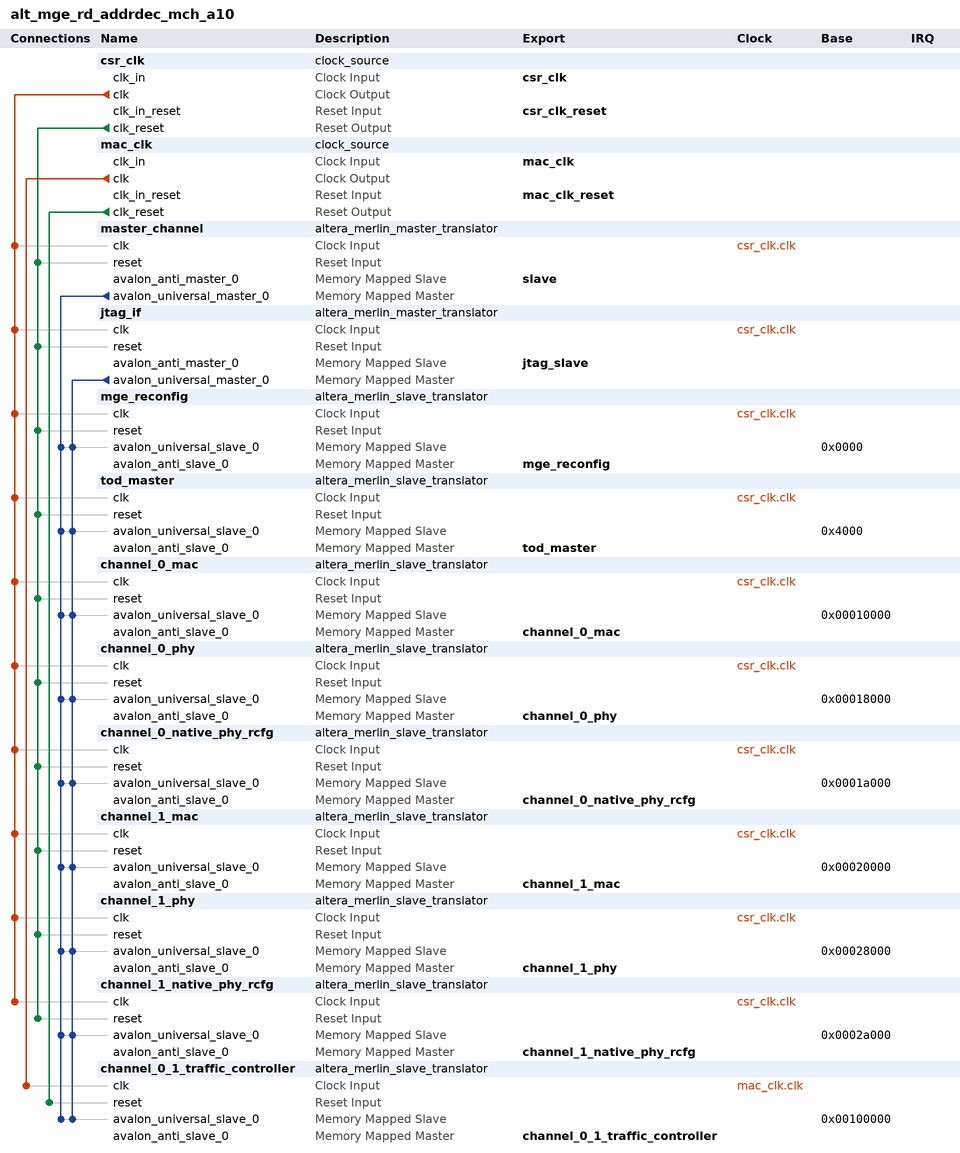
[diagram p0: system contents]
# Platform Designer (Qsys) system alt_mge_rd_addrdec_mch_a10, Arria 10 10AX115S4F45I3SG
# Parameters at their usual value, and those the tool derives, are not listed.
package require -exact qsys 15.1
create_system alt_mge_rd_addrdec_mch_a10
set_project_property DEVICE_FAMILY {Arria 10}
set_project_property DEVICE 10AX115S4F45I3SG

add_instance csr_clk clock_source 15.1
set_instance_parameter_value csr_clk clockFrequency 125000000

add_instance mac_clk clock_source 15.1
set_instance_parameter_value mac_clk clockFrequency 156250000

add_instance master_channel altera_merlin_master_translator 15.1
set_instance_parameter_value master_channel AV_ADDRESSGROUP 0
set_instance_parameter_value master_channel AV_ADDRESS_SYMBOLS 1
set_instance_parameter_value master_channel AV_ADDRESS_W 24
set_instance_parameter_value master_channel AV_ALWAYSBURSTMAXBURST 0
set_instance_parameter_value master_channel AV_BITS_PER_SYMBOL 8
set_instance_parameter_value master_channel AV_BURSTBOUNDARIES 0
set_instance_parameter_value master_channel AV_BURSTCOUNT_SYMBOLS 1
set_instance_parameter_value master_channel AV_BURSTCOUNT_W 3
set_instance_parameter_value master_channel AV_BYTEENABLE_W 4
set_instance_parameter_value master_channel AV_CONSTANT_BURST_BEHAVIOR 0
set_instance_parameter_value master_channel AV_DATA_HOLD 0
set_instance_parameter_value master_channel AV_DATA_W 32
set_instance_parameter_value master_channel AV_INTERLEAVEBURSTS 0
set_instance_parameter_value master_channel AV_ISBIGENDIAN 0
set_instance_parameter_value master_channel AV_LINEWRAPBURSTS 0
set_instance_parameter_value master_channel AV_MAX_PENDING_READ_TRANSACTIONS 0
set_instance_parameter_value master_channel AV_READLATENCY 0
set_instance_parameter_value master_channel AV_READ_WAIT 0
set_instance_parameter_value master_channel AV_REGISTERINCOMINGSIGNALS 0
set_instance_parameter_value master_channel AV_REGISTEROUTGOINGSIGNALS 0
set_instance_parameter_value master_channel AV_SETUP_WAIT 0
set_instance_parameter_value master_channel AV_SYMBOLS_PER_WORD 4
set_instance_parameter_value master_channel AV_WRITE_WAIT 0
set_instance_parameter_value master_channel SYNC_RESET 0
set_instance_parameter_value master_channel UAV_ADDRESSGROUP 0
set_instance_parameter_value master_channel UAV_ADDRESS_W 32
set_instance_parameter_value master_channel UAV_BURSTCOUNT_W 3
set_instance_parameter_value master_channel UAV_CONSTANT_BURST_BEHAVIOR 0
set_instance_parameter_value master_channel USE_ADDRESS 1
set_instance_parameter_value master_channel USE_BEGINBURSTTRANSFER 0
set_instance_parameter_value master_channel USE_BEGINTRANSFER 0
set_instance_parameter_value master_channel USE_BURSTCOUNT 0
set_instance_parameter_value master_channel USE_BYTEENABLE 0
set_instance_parameter_value master_channel USE_CHIPSELECT 0
set_instance_parameter_value master_channel USE_CLKEN 0
set_instance_parameter_value master_channel USE_DEBUGACCESS 0
set_instance_parameter_value master_channel USE_LOCK 0
set_instance_parameter_value master_channel USE_READ 1
set_instance_parameter_value master_channel USE_READDATA 1
set_instance_parameter_value master_channel USE_READDATAVALID 0
set_instance_parameter_value master_channel USE_READRESPONSE 0
set_instance_parameter_value master_channel USE_WAITREQUEST 1
set_instance_parameter_value master_channel USE_WRITE 1
set_instance_parameter_value master_channel USE_WRITEDATA 1
set_instance_parameter_value master_channel USE_WRITERESPONSE 0

add_instance jtag_if altera_merlin_master_translator 15.1
set_instance_parameter_value jtag_if AV_ADDRESSGROUP 0
set_instance_parameter_value jtag_if AV_ADDRESS_SYMBOLS 1
set_instance_parameter_value jtag_if AV_ADDRESS_W 32
set_instance_parameter_value jtag_if AV_ALWAYSBURSTMAXBURST 0
set_instance_parameter_value jtag_if AV_BITS_PER_SYMBOL 8
set_instance_parameter_value jtag_if AV_BURSTBOUNDARIES 0
set_instance_parameter_value jtag_if AV_BURSTCOUNT_SYMBOLS 1
set_instance_parameter_value jtag_if AV_BURSTCOUNT_W 3
set_instance_parameter_value jtag_if AV_BYTEENABLE_W 4
set_instance_parameter_value jtag_if AV_CONSTANT_BURST_BEHAVIOR 0
set_instance_parameter_value jtag_if AV_DATA_HOLD 0
set_instance_parameter_value jtag_if AV_DATA_W 32
set_instance_parameter_value jtag_if AV_INTERLEAVEBURSTS 0
set_instance_parameter_value jtag_if AV_ISBIGENDIAN 0
set_instance_parameter_value jtag_if AV_LINEWRAPBURSTS 0
set_instance_parameter_value jtag_if AV_MAX_PENDING_READ_TRANSACTIONS 1
set_instance_parameter_value jtag_if AV_READLATENCY 0
set_instance_parameter_value jtag_if AV_READ_WAIT 0
set_instance_parameter_value jtag_if AV_REGISTERINCOMINGSIGNALS 0
set_instance_parameter_value jtag_if AV_REGISTEROUTGOINGSIGNALS 0
set_instance_parameter_value jtag_if AV_SETUP_WAIT 0
set_instance_parameter_value jtag_if AV_SYMBOLS_PER_WORD 4
set_instance_parameter_value jtag_if AV_WRITE_WAIT 0
set_instance_parameter_value jtag_if SYNC_RESET 0
set_instance_parameter_value jtag_if UAV_ADDRESSGROUP 0
set_instance_parameter_value jtag_if UAV_ADDRESS_W 32
set_instance_parameter_value jtag_if UAV_BURSTCOUNT_W 3
set_instance_parameter_value jtag_if UAV_CONSTANT_BURST_BEHAVIOR 0
set_instance_parameter_value jtag_if USE_ADDRESS 1
set_instance_parameter_value jtag_if USE_BEGINBURSTTRANSFER 0
set_instance_parameter_value jtag_if USE_BEGINTRANSFER 0
set_instance_parameter_value jtag_if USE_BURSTCOUNT 0
set_instance_parameter_value jtag_if USE_BYTEENABLE 0
set_instance_parameter_value jtag_if USE_CHIPSELECT 0
set_instance_parameter_value jtag_if USE_CLKEN 0
set_instance_parameter_value jtag_if USE_DEBUGACCESS 0
set_instance_parameter_value jtag_if USE_LOCK 0
set_instance_parameter_value jtag_if USE_READ 1
set_instance_parameter_value jtag_if USE_READDATA 1
set_instance_parameter_value jtag_if USE_READDATAVALID 1
set_instance_parameter_value jtag_if USE_READRESPONSE 0
set_instance_parameter_value jtag_if USE_WAITREQUEST 1
set_instance_parameter_value jtag_if USE_WRITE 1
set_instance_parameter_value jtag_if USE_WRITEDATA 1
set_instance_parameter_value jtag_if USE_WRITERESPONSE 0

add_instance mge_reconfig altera_merlin_slave_translator 15.1
set_instance_parameter_value mge_reconfig AV_ADDRESSGROUP 0
set_instance_parameter_value mge_reconfig AV_ADDRESS_SYMBOLS 0
set_instance_parameter_value mge_reconfig AV_ADDRESS_W 2
set_instance_parameter_value mge_reconfig AV_ALWAYSBURSTMAXBURST 0
set_instance_parameter_value mge_reconfig AV_BITS_PER_SYMBOL 8
set_instance_parameter_value mge_reconfig AV_BURSTBOUNDARIES 0
set_instance_parameter_value mge_reconfig AV_BURSTCOUNT_SYMBOLS 1
set_instance_parameter_value mge_reconfig AV_BURSTCOUNT_W 1
set_instance_parameter_value mge_reconfig AV_BYTEENABLE_W 4
set_instance_parameter_value mge_reconfig AV_CONSTANT_BURST_BEHAVIOR 0
set_instance_parameter_value mge_reconfig AV_DATA_HOLD 0
set_instance_parameter_value mge_reconfig AV_DATA_W 32
set_instance_parameter_value mge_reconfig AV_INTERLEAVEBURSTS 0
set_instance_parameter_value mge_reconfig AV_ISBIGENDIAN 0
set_instance_parameter_value mge_reconfig AV_LINEWRAPBURSTS 0
set_instance_parameter_value mge_reconfig AV_MAX_PENDING_READ_TRANSACTIONS 1
set_instance_parameter_value mge_reconfig AV_MAX_PENDING_WRITE_TRANSACTIONS 0
set_instance_parameter_value mge_reconfig AV_READLATENCY 1
set_instance_parameter_value mge_reconfig AV_READ_WAIT 0
set_instance_parameter_value mge_reconfig AV_REGISTERINCOMINGSIGNALS 0
set_instance_parameter_value mge_reconfig AV_REGISTEROUTGOINGSIGNALS 0
set_instance_parameter_value mge_reconfig AV_REQUIRE_UNALIGNED_ADDRESSES 0
set_instance_parameter_value mge_reconfig AV_SETUP_WAIT 0
set_instance_parameter_value mge_reconfig AV_SYMBOLS_PER_WORD 4
set_instance_parameter_value mge_reconfig AV_TIMING_UNITS 1
set_instance_parameter_value mge_reconfig AV_WRITE_WAIT 0
set_instance_parameter_value mge_reconfig CHIPSELECT_THROUGH_READLATENCY 0
set_instance_parameter_value mge_reconfig CLOCK_RATE 125000000
set_instance_parameter_value mge_reconfig UAV_ADDRESSGROUP 0
set_instance_parameter_value mge_reconfig UAV_ADDRESS_W 4
set_instance_parameter_value mge_reconfig UAV_BURSTCOUNT_W 3
set_instance_parameter_value mge_reconfig UAV_BYTEENABLE_W 4
set_instance_parameter_value mge_reconfig UAV_CONSTANT_BURST_BEHAVIOR 0
set_instance_parameter_value mge_reconfig UAV_DATA_W 32
set_instance_parameter_value mge_reconfig USE_ADDRESS 1
set_instance_parameter_value mge_reconfig USE_AV_CLKEN 0
set_instance_parameter_value mge_reconfig USE_BEGINBURSTTRANSFER 0
set_instance_parameter_value mge_reconfig USE_BEGINTRANSFER 0
set_instance_parameter_value mge_reconfig USE_BURSTCOUNT 0
set_instance_parameter_value mge_reconfig USE_BYTEENABLE 0
set_instance_parameter_value mge_reconfig USE_CHIPSELECT 0
set_instance_parameter_value mge_reconfig USE_DEBUGACCESS 0
set_instance_parameter_value mge_reconfig USE_LOCK 0
set_instance_parameter_value mge_reconfig USE_OUTPUTENABLE 0
set_instance_parameter_value mge_reconfig USE_READ 1
set_instance_parameter_value mge_reconfig USE_READDATA 1
set_instance_parameter_value mge_reconfig USE_READDATAVALID 0
set_instance_parameter_value mge_reconfig USE_READRESPONSE 0
set_instance_parameter_value mge_reconfig USE_UAV_CLKEN 0
set_instance_parameter_value mge_reconfig USE_WAITREQUEST 0
set_instance_parameter_value mge_reconfig USE_WRITE 1
set_instance_parameter_value mge_reconfig USE_WRITEBYTEENABLE 0
set_instance_parameter_value mge_reconfig USE_WRITEDATA 1
set_instance_parameter_value mge_reconfig USE_WRITERESPONSE 0

add_instance tod_master altera_merlin_slave_translator 15.1
set_instance_parameter_value tod_master AV_ADDRESSGROUP 0
set_instance_parameter_value tod_master AV_ADDRESS_SYMBOLS 0
set_instance_parameter_value tod_master AV_ADDRESS_W 4
set_instance_parameter_value tod_master AV_ALWAYSBURSTMAXBURST 0
set_instance_parameter_value tod_master AV_BITS_PER_SYMBOL 8
set_instance_parameter_value tod_master AV_BURSTBOUNDARIES 0
set_instance_parameter_value tod_master AV_BURSTCOUNT_SYMBOLS 1
set_instance_parameter_value tod_master AV_BURSTCOUNT_W 1
set_instance_parameter_value tod_master AV_BYTEENABLE_W 4
set_instance_parameter_value tod_master AV_CONSTANT_BURST_BEHAVIOR 0
set_instance_parameter_value tod_master AV_DATA_HOLD 0
set_instance_parameter_value tod_master AV_DATA_W 32
set_instance_parameter_value tod_master AV_INTERLEAVEBURSTS 0
set_instance_parameter_value tod_master AV_ISBIGENDIAN 0
set_instance_parameter_value tod_master AV_LINEWRAPBURSTS 0
set_instance_parameter_value tod_master AV_MAX_PENDING_READ_TRANSACTIONS 1
set_instance_parameter_value tod_master AV_MAX_PENDING_WRITE_TRANSACTIONS 0
set_instance_parameter_value tod_master AV_READLATENCY 0
set_instance_parameter_value tod_master AV_READ_WAIT 0
set_instance_parameter_value tod_master AV_REGISTERINCOMINGSIGNALS 0
set_instance_parameter_value tod_master AV_REGISTEROUTGOINGSIGNALS 0
set_instance_parameter_value tod_master AV_REQUIRE_UNALIGNED_ADDRESSES 0
set_instance_parameter_value tod_master AV_SETUP_WAIT 0
set_instance_parameter_value tod_master AV_SYMBOLS_PER_WORD 4
set_instance_parameter_value tod_master AV_TIMING_UNITS 1
set_instance_parameter_value tod_master AV_WRITE_WAIT 0
set_instance_parameter_value tod_master CHIPSELECT_THROUGH_READLATENCY 0
set_instance_parameter_value tod_master CLOCK_RATE 125000000
set_instance_parameter_value tod_master UAV_ADDRESSGROUP 0
set_instance_parameter_value tod_master UAV_ADDRESS_W 6
set_instance_parameter_value tod_master UAV_BURSTCOUNT_W 3
set_instance_parameter_value tod_master UAV_BYTEENABLE_W 4
set_instance_parameter_value tod_master UAV_CONSTANT_BURST_BEHAVIOR 0
set_instance_parameter_value tod_master UAV_DATA_W 32
set_instance_parameter_value tod_master USE_ADDRESS 1
set_instance_parameter_value tod_master USE_AV_CLKEN 0
set_instance_parameter_value tod_master USE_BEGINBURSTTRANSFER 0
set_instance_parameter_value tod_master USE_BEGINTRANSFER 0
set_instance_parameter_value tod_master USE_BURSTCOUNT 0
set_instance_parameter_value tod_master USE_BYTEENABLE 0
set_instance_parameter_value tod_master USE_CHIPSELECT 0
set_instance_parameter_value tod_master USE_DEBUGACCESS 0
set_instance_parameter_value tod_master USE_LOCK 0
set_instance_parameter_value tod_master USE_OUTPUTENABLE 0
set_instance_parameter_value tod_master USE_READ 1
set_instance_parameter_value tod_master USE_READDATA 1
set_instance_parameter_value tod_master USE_READDATAVALID 0
set_instance_parameter_value tod_master USE_READRESPONSE 0
set_instance_parameter_value tod_master USE_UAV_CLKEN 0
set_instance_parameter_value tod_master USE_WAITREQUEST 1
set_instance_parameter_value tod_master USE_WRITE 1
set_instance_parameter_value tod_master USE_WRITEBYTEENABLE 0
set_instance_parameter_value tod_master USE_WRITEDATA 1
set_instance_parameter_value tod_master USE_WRITERESPONSE 0

add_instance channel_0_mac altera_merlin_slave_translator 15.1
set_instance_parameter_value channel_0_mac AV_ADDRESSGROUP 0
set_instance_parameter_value channel_0_mac AV_ADDRESS_SYMBOLS 0
set_instance_parameter_value channel_0_mac AV_ADDRESS_W 10
set_instance_parameter_value channel_0_mac AV_ALWAYSBURSTMAXBURST 0
set_instance_parameter_value channel_0_mac AV_BITS_PER_SYMBOL 8
set_instance_parameter_value channel_0_mac AV_BURSTBOUNDARIES 0
set_instance_parameter_value channel_0_mac AV_BURSTCOUNT_SYMBOLS 1
set_instance_parameter_value channel_0_mac AV_BURSTCOUNT_W 1
set_instance_parameter_value channel_0_mac AV_BYTEENABLE_W 4
set_instance_parameter_value channel_0_mac AV_CONSTANT_BURST_BEHAVIOR 0
set_instance_parameter_value channel_0_mac AV_DATA_HOLD 0
set_instance_parameter_value channel_0_mac AV_DATA_W 32
set_instance_parameter_value channel_0_mac AV_INTERLEAVEBURSTS 0
set_instance_parameter_value channel_0_mac AV_ISBIGENDIAN 0
set_instance_parameter_value channel_0_mac AV_LINEWRAPBURSTS 0
set_instance_parameter_value channel_0_mac AV_MAX_PENDING_READ_TRANSACTIONS 1
set_instance_parameter_value channel_0_mac AV_MAX_PENDING_WRITE_TRANSACTIONS 0
set_instance_parameter_value channel_0_mac AV_READLATENCY 0
set_instance_parameter_value channel_0_mac AV_READ_WAIT 0
set_instance_parameter_value channel_0_mac AV_REGISTERINCOMINGSIGNALS 0
set_instance_parameter_value channel_0_mac AV_REGISTEROUTGOINGSIGNALS 0
set_instance_parameter_value channel_0_mac AV_REQUIRE_UNALIGNED_ADDRESSES 0
set_instance_parameter_value channel_0_mac AV_SETUP_WAIT 0
set_instance_parameter_value channel_0_mac AV_SYMBOLS_PER_WORD 4
set_instance_parameter_value channel_0_mac AV_TIMING_UNITS 1
set_instance_parameter_value channel_0_mac AV_WRITE_WAIT 0
set_instance_parameter_value channel_0_mac CHIPSELECT_THROUGH_READLATENCY 0
set_instance_parameter_value channel_0_mac CLOCK_RATE 125000000
set_instance_parameter_value channel_0_mac UAV_ADDRESSGROUP 0
set_instance_parameter_value channel_0_mac UAV_ADDRESS_W 12
set_instance_parameter_value channel_0_mac UAV_BURSTCOUNT_W 3
set_instance_parameter_value channel_0_mac UAV_BYTEENABLE_W 4
set_instance_parameter_value channel_0_mac UAV_CONSTANT_BURST_BEHAVIOR 0
set_instance_parameter_value channel_0_mac UAV_DATA_W 32
set_instance_parameter_value channel_0_mac USE_ADDRESS 1
set_instance_parameter_value channel_0_mac USE_AV_CLKEN 0
set_instance_parameter_value channel_0_mac USE_BEGINBURSTTRANSFER 0
set_instance_parameter_value channel_0_mac USE_BEGINTRANSFER 0
set_instance_parameter_value channel_0_mac USE_BURSTCOUNT 0
set_instance_parameter_value channel_0_mac USE_BYTEENABLE 0
set_instance_parameter_value channel_0_mac USE_CHIPSELECT 0
set_instance_parameter_value channel_0_mac USE_DEBUGACCESS 0
set_instance_parameter_value channel_0_mac USE_LOCK 0
set_instance_parameter_value channel_0_mac USE_OUTPUTENABLE 0
set_instance_parameter_value channel_0_mac USE_READ 1
set_instance_parameter_value channel_0_mac USE_READDATA 1
set_instance_parameter_value channel_0_mac USE_READDATAVALID 0
set_instance_parameter_value channel_0_mac USE_READRESPONSE 0
set_instance_parameter_value channel_0_mac USE_UAV_CLKEN 0
set_instance_parameter_value channel_0_mac USE_WAITREQUEST 1
set_instance_parameter_value channel_0_mac USE_WRITE 1
set_instance_parameter_value channel_0_mac USE_WRITEBYTEENABLE 0
set_instance_parameter_value channel_0_mac USE_WRITEDATA 1
set_instance_parameter_value channel_0_mac USE_WRITERESPONSE 0

add_instance channel_0_phy altera_merlin_slave_translator 15.1
set_instance_parameter_value channel_0_phy AV_ADDRESSGROUP 0
set_instance_parameter_value channel_0_phy AV_ADDRESS_SYMBOLS 0
set_instance_parameter_value channel_0_phy AV_ADDRESS_W 5
set_instance_parameter_value channel_0_phy AV_ALWAYSBURSTMAXBURST 0
set_instance_parameter_value channel_0_phy AV_BITS_PER_SYMBOL 8
set_instance_parameter_value channel_0_phy AV_BURSTBOUNDARIES 0
set_instance_parameter_value channel_0_phy AV_BURSTCOUNT_SYMBOLS 1
set_instance_parameter_value channel_0_phy AV_BURSTCOUNT_W 1
set_instance_parameter_value channel_0_phy AV_BYTEENABLE_W 4
set_instance_parameter_value channel_0_phy AV_CONSTANT_BURST_BEHAVIOR 0
set_instance_parameter_value channel_0_phy AV_DATA_HOLD 0
set_instance_parameter_value channel_0_phy AV_DATA_W 32
set_instance_parameter_value channel_0_phy AV_INTERLEAVEBURSTS 0
set_instance_parameter_value channel_0_phy AV_ISBIGENDIAN 0
set_instance_parameter_value channel_0_phy AV_LINEWRAPBURSTS 0
set_instance_parameter_value channel_0_phy AV_MAX_PENDING_READ_TRANSACTIONS 1
set_instance_parameter_value channel_0_phy AV_MAX_PENDING_WRITE_TRANSACTIONS 0
set_instance_parameter_value channel_0_phy AV_READLATENCY 0
set_instance_parameter_value channel_0_phy AV_READ_WAIT 0
set_instance_parameter_value channel_0_phy AV_REGISTERINCOMINGSIGNALS 0
set_instance_parameter_value channel_0_phy AV_REGISTEROUTGOINGSIGNALS 0
set_instance_parameter_value channel_0_phy AV_REQUIRE_UNALIGNED_ADDRESSES 0
set_instance_parameter_value channel_0_phy AV_SETUP_WAIT 0
set_instance_parameter_value channel_0_phy AV_SYMBOLS_PER_WORD 4
set_instance_parameter_value channel_0_phy AV_TIMING_UNITS 1
set_instance_parameter_value channel_0_phy AV_WRITE_WAIT 0
set_instance_parameter_value channel_0_phy CHIPSELECT_THROUGH_READLATENCY 0
set_instance_parameter_value channel_0_phy CLOCK_RATE 125000000
set_instance_parameter_value channel_0_phy UAV_ADDRESSGROUP 0
set_instance_parameter_value channel_0_phy UAV_ADDRESS_W 7
set_instance_parameter_value channel_0_phy UAV_BURSTCOUNT_W 3
set_instance_parameter_value channel_0_phy UAV_BYTEENABLE_W 4
set_instance_parameter_value channel_0_phy UAV_CONSTANT_BURST_BEHAVIOR 0
set_instance_parameter_value channel_0_phy UAV_DATA_W 32
set_instance_parameter_value channel_0_phy USE_ADDRESS 1
set_instance_parameter_value channel_0_phy USE_AV_CLKEN 0
set_instance_parameter_value channel_0_phy USE_BEGINBURSTTRANSFER 0
set_instance_parameter_value channel_0_phy USE_BEGINTRANSFER 0
set_instance_parameter_value channel_0_phy USE_BURSTCOUNT 0
set_instance_parameter_value channel_0_phy USE_BYTEENABLE 0
set_instance_parameter_value channel_0_phy USE_CHIPSELECT 0
set_instance_parameter_value channel_0_phy USE_DEBUGACCESS 0
set_instance_parameter_value channel_0_phy USE_LOCK 0
set_instance_parameter_value channel_0_phy USE_OUTPUTENABLE 0
set_instance_parameter_value channel_0_phy USE_READ 1
set_instance_parameter_value channel_0_phy USE_READDATA 1
set_instance_parameter_value channel_0_phy USE_READDATAVALID 0
set_instance_parameter_value channel_0_phy USE_READRESPONSE 0
set_instance_parameter_value channel_0_phy USE_UAV_CLKEN 0
set_instance_parameter_value channel_0_phy USE_WAITREQUEST 1
set_instance_parameter_value channel_0_phy USE_WRITE 1
set_instance_parameter_value channel_0_phy USE_WRITEBYTEENABLE 0
set_instance_parameter_value channel_0_phy USE_WRITEDATA 1
set_instance_parameter_value channel_0_phy USE_WRITERESPONSE 0

add_instance channel_0_native_phy_rcfg altera_merlin_slave_translator 15.1
set_instance_parameter_value channel_0_native_phy_rcfg AV_ADDRESSGROUP 0
set_instance_parameter_value channel_0_native_phy_rcfg AV_ADDRESS_SYMBOLS 0
set_instance_parameter_value channel_0_native_phy_rcfg AV_ADDRESS_W 10
set_instance_parameter_value channel_0_native_phy_rcfg AV_ALWAYSBURSTMAXBURST 0
set_instance_parameter_value channel_0_native_phy_rcfg AV_BITS_PER_SYMBOL 8
set_instance_parameter_value channel_0_native_phy_rcfg AV_BURSTBOUNDARIES 0
set_instance_parameter_value channel_0_native_phy_rcfg AV_BURSTCOUNT_SYMBOLS 1
set_instance_parameter_value channel_0_native_phy_rcfg AV_BURSTCOUNT_W 1
set_instance_parameter_value channel_0_native_phy_rcfg AV_BYTEENABLE_W 4
set_instance_parameter_value channel_0_native_phy_rcfg AV_CONSTANT_BURST_BEHAVIOR 0
set_instance_parameter_value channel_0_native_phy_rcfg AV_DATA_HOLD 0
set_instance_parameter_value channel_0_native_phy_rcfg AV_DATA_W 32
set_instance_parameter_value channel_0_native_phy_rcfg AV_INTERLEAVEBURSTS 0
set_instance_parameter_value channel_0_native_phy_rcfg AV_ISBIGENDIAN 0
set_instance_parameter_value channel_0_native_phy_rcfg AV_LINEWRAPBURSTS 0
set_instance_parameter_value channel_0_native_phy_rcfg AV_MAX_PENDING_READ_TRANSACTIONS 1
set_instance_parameter_value channel_0_native_phy_rcfg AV_MAX_PENDING_WRITE_TRANSACTIONS 0
set_instance_parameter_value channel_0_native_phy_rcfg AV_READLATENCY 0
set_instance_parameter_value channel_0_native_phy_rcfg AV_READ_WAIT 0
set_instance_parameter_value channel_0_native_phy_rcfg AV_REGISTERINCOMINGSIGNALS 0
set_instance_parameter_value channel_0_native_phy_rcfg AV_REGISTEROUTGOINGSIGNALS 0
set_instance_parameter_value channel_0_native_phy_rcfg AV_REQUIRE_UNALIGNED_ADDRESSES 0
set_instance_parameter_value channel_0_native_phy_rcfg AV_SETUP_WAIT 0
set_instance_parameter_value channel_0_native_phy_rcfg AV_SYMBOLS_PER_WORD 4
set_instance_parameter_value channel_0_native_phy_rcfg AV_TIMING_UNITS 1
set_instance_parameter_value channel_0_native_phy_rcfg AV_WRITE_WAIT 0
set_instance_parameter_value channel_0_native_phy_rcfg CHIPSELECT_THROUGH_READLATENCY 0
set_instance_parameter_value channel_0_native_phy_rcfg CLOCK_RATE 125000000
set_instance_parameter_value channel_0_native_phy_rcfg UAV_ADDRESSGROUP 0
set_instance_parameter_value channel_0_native_phy_rcfg UAV_ADDRESS_W 12
set_instance_parameter_value channel_0_native_phy_rcfg UAV_BURSTCOUNT_W 3
set_instance_parameter_value channel_0_native_phy_rcfg UAV_BYTEENABLE_W 4
set_instance_parameter_value channel_0_native_phy_rcfg UAV_CONSTANT_BURST_BEHAVIOR 0
set_instance_parameter_value channel_0_native_phy_rcfg UAV_DATA_W 32
set_instance_parameter_value channel_0_native_phy_rcfg USE_ADDRESS 1
set_instance_parameter_value channel_0_native_phy_rcfg USE_AV_CLKEN 0
set_instance_parameter_value channel_0_native_phy_rcfg USE_BEGINBURSTTRANSFER 0
set_instance_parameter_value channel_0_native_phy_rcfg USE_BEGINTRANSFER 0
set_instance_parameter_value channel_0_native_phy_rcfg USE_BURSTCOUNT 0
set_instance_parameter_value channel_0_native_phy_rcfg USE_BYTEENABLE 0
set_instance_parameter_value channel_0_native_phy_rcfg USE_CHIPSELECT 0
set_instance_parameter_value channel_0_native_phy_rcfg USE_DEBUGACCESS 0
set_instance_parameter_value channel_0_native_phy_rcfg USE_LOCK 0
set_instance_parameter_value channel_0_native_phy_rcfg USE_OUTPUTENABLE 0
set_instance_parameter_value channel_0_native_phy_rcfg USE_READ 1
set_instance_parameter_value channel_0_native_phy_rcfg USE_READDATA 1
set_instance_parameter_value channel_0_native_phy_rcfg USE_READDATAVALID 0
set_instance_parameter_value channel_0_native_phy_rcfg USE_READRESPONSE 0
set_instance_parameter_value channel_0_native_phy_rcfg USE_UAV_CLKEN 0
set_instance_parameter_value channel_0_native_phy_rcfg USE_WAITREQUEST 1
set_instance_parameter_value channel_0_native_phy_rcfg USE_WRITE 1
set_instance_parameter_value channel_0_native_phy_rcfg USE_WRITEBYTEENABLE 0
set_instance_parameter_value channel_0_native_phy_rcfg USE_WRITEDATA 1
set_instance_parameter_value channel_0_native_phy_rcfg USE_WRITERESPONSE 0

add_instance channel_1_mac altera_merlin_slave_translator 15.1
set_instance_parameter_value channel_1_mac AV_ADDRESSGROUP 0
set_instance_parameter_value channel_1_mac AV_ADDRESS_SYMBOLS 0
set_instance_parameter_value channel_1_mac AV_ADDRESS_W 10
set_instance_parameter_value channel_1_mac AV_ALWAYSBURSTMAXBURST 0
set_instance_parameter_value channel_1_mac AV_BITS_PER_SYMBOL 8
set_instance_parameter_value channel_1_mac AV_BURSTBOUNDARIES 0
set_instance_parameter_value channel_1_mac AV_BURSTCOUNT_SYMBOLS 1
set_instance_parameter_value channel_1_mac AV_BURSTCOUNT_W 1
set_instance_parameter_value channel_1_mac AV_BYTEENABLE_W 4
set_instance_parameter_value channel_1_mac AV_CONSTANT_BURST_BEHAVIOR 0
set_instance_parameter_value channel_1_mac AV_DATA_HOLD 0
set_instance_parameter_value channel_1_mac AV_DATA_W 32
set_instance_parameter_value channel_1_mac AV_INTERLEAVEBURSTS 0
set_instance_parameter_value channel_1_mac AV_ISBIGENDIAN 0
set_instance_parameter_value channel_1_mac AV_LINEWRAPBURSTS 0
set_instance_parameter_value channel_1_mac AV_MAX_PENDING_READ_TRANSACTIONS 1
set_instance_parameter_value channel_1_mac AV_MAX_PENDING_WRITE_TRANSACTIONS 0
set_instance_parameter_value channel_1_mac AV_READLATENCY 0
set_instance_parameter_value channel_1_mac AV_READ_WAIT 0
set_instance_parameter_value channel_1_mac AV_REGISTERINCOMINGSIGNALS 0
set_instance_parameter_value channel_1_mac AV_REGISTEROUTGOINGSIGNALS 0
set_instance_parameter_value channel_1_mac AV_REQUIRE_UNALIGNED_ADDRESSES 0
set_instance_parameter_value channel_1_mac AV_SETUP_WAIT 0
set_instance_parameter_value channel_1_mac AV_SYMBOLS_PER_WORD 4
set_instance_parameter_value channel_1_mac AV_TIMING_UNITS 1
set_instance_parameter_value channel_1_mac AV_WRITE_WAIT 0
set_instance_parameter_value channel_1_mac CHIPSELECT_THROUGH_READLATENCY 0
set_instance_parameter_value channel_1_mac CLOCK_RATE 125000000
set_instance_parameter_value channel_1_mac UAV_ADDRESSGROUP 0
set_instance_parameter_value channel_1_mac UAV_ADDRESS_W 12
set_instance_parameter_value channel_1_mac UAV_BURSTCOUNT_W 3
set_instance_parameter_value channel_1_mac UAV_BYTEENABLE_W 4
set_instance_parameter_value channel_1_mac UAV_CONSTANT_BURST_BEHAVIOR 0
set_instance_parameter_value channel_1_mac UAV_DATA_W 32
set_instance_parameter_value channel_1_mac USE_ADDRESS 1
set_instance_parameter_value channel_1_mac USE_AV_CLKEN 0
set_instance_parameter_value channel_1_mac USE_BEGINBURSTTRANSFER 0
set_instance_parameter_value channel_1_mac USE_BEGINTRANSFER 0
set_instance_parameter_value channel_1_mac USE_BURSTCOUNT 0
set_instance_parameter_value channel_1_mac USE_BYTEENABLE 0
set_instance_parameter_value channel_1_mac USE_CHIPSELECT 0
set_instance_parameter_value channel_1_mac USE_DEBUGACCESS 0
set_instance_parameter_value channel_1_mac USE_LOCK 0
set_instance_parameter_value channel_1_mac USE_OUTPUTENABLE 0
set_instance_parameter_value channel_1_mac USE_READ 1
set_instance_parameter_value channel_1_mac USE_READDATA 1
set_instance_parameter_value channel_1_mac USE_READDATAVALID 0
set_instance_parameter_value channel_1_mac USE_READRESPONSE 0
set_instance_parameter_value channel_1_mac USE_UAV_CLKEN 0
set_instance_parameter_value channel_1_mac USE_WAITREQUEST 1
set_instance_parameter_value channel_1_mac USE_WRITE 1
set_instance_parameter_value channel_1_mac USE_WRITEBYTEENABLE 0
set_instance_parameter_value channel_1_mac USE_WRITEDATA 1
set_instance_parameter_value channel_1_mac USE_WRITERESPONSE 0

add_instance channel_1_phy altera_merlin_slave_translator 15.1
set_instance_parameter_value channel_1_phy AV_ADDRESSGROUP 0
set_instance_parameter_value channel_1_phy AV_ADDRESS_SYMBOLS 0
set_instance_parameter_value channel_1_phy AV_ADDRESS_W 5
set_instance_parameter_value channel_1_phy AV_ALWAYSBURSTMAXBURST 0
set_instance_parameter_value channel_1_phy AV_BITS_PER_SYMBOL 8
set_instance_parameter_value channel_1_phy AV_BURSTBOUNDARIES 0
set_instance_parameter_value channel_1_phy AV_BURSTCOUNT_SYMBOLS 1
set_instance_parameter_value channel_1_phy AV_BURSTCOUNT_W 1
set_instance_parameter_value channel_1_phy AV_BYTEENABLE_W 4
set_instance_parameter_value channel_1_phy AV_CONSTANT_BURST_BEHAVIOR 0
set_instance_parameter_value channel_1_phy AV_DATA_HOLD 0
set_instance_parameter_value channel_1_phy AV_DATA_W 32
set_instance_parameter_value channel_1_phy AV_INTERLEAVEBURSTS 0
set_instance_parameter_value channel_1_phy AV_ISBIGENDIAN 0
set_instance_parameter_value channel_1_phy AV_LINEWRAPBURSTS 0
set_instance_parameter_value channel_1_phy AV_MAX_PENDING_READ_TRANSACTIONS 1
set_instance_parameter_value channel_1_phy AV_MAX_PENDING_WRITE_TRANSACTIONS 0
set_instance_parameter_value channel_1_phy AV_READLATENCY 0
set_instance_parameter_value channel_1_phy AV_READ_WAIT 0
set_instance_parameter_value channel_1_phy AV_REGISTERINCOMINGSIGNALS 0
set_instance_parameter_value channel_1_phy AV_REGISTEROUTGOINGSIGNALS 0
set_instance_parameter_value channel_1_phy AV_REQUIRE_UNALIGNED_ADDRESSES 0
set_instance_parameter_value channel_1_phy AV_SETUP_WAIT 0
set_instance_parameter_value channel_1_phy AV_SYMBOLS_PER_WORD 4
set_instance_parameter_value channel_1_phy AV_TIMING_UNITS 1
set_instance_parameter_value channel_1_phy AV_WRITE_WAIT 0
set_instance_parameter_value channel_1_phy CHIPSELECT_THROUGH_READLATENCY 0
set_instance_parameter_value channel_1_phy CLOCK_RATE 125000000
set_instance_parameter_value channel_1_phy UAV_ADDRESSGROUP 0
set_instance_parameter_value channel_1_phy UAV_ADDRESS_W 7
set_instance_parameter_value channel_1_phy UAV_BURSTCOUNT_W 3
set_instance_parameter_value channel_1_phy UAV_BYTEENABLE_W 4
set_instance_parameter_value channel_1_phy UAV_CONSTANT_BURST_BEHAVIOR 0
set_instance_parameter_value channel_1_phy UAV_DATA_W 32
set_instance_parameter_value channel_1_phy USE_ADDRESS 1
set_instance_parameter_value channel_1_phy USE_AV_CLKEN 0
set_instance_parameter_value channel_1_phy USE_BEGINBURSTTRANSFER 0
set_instance_parameter_value channel_1_phy USE_BEGINTRANSFER 0
set_instance_parameter_value channel_1_phy USE_BURSTCOUNT 0
set_instance_parameter_value channel_1_phy USE_BYTEENABLE 0
set_instance_parameter_value channel_1_phy USE_CHIPSELECT 0
set_instance_parameter_value channel_1_phy USE_DEBUGACCESS 0
set_instance_parameter_value channel_1_phy USE_LOCK 0
set_instance_parameter_value channel_1_phy USE_OUTPUTENABLE 0
set_instance_parameter_value channel_1_phy USE_READ 1
set_instance_parameter_value channel_1_phy USE_READDATA 1
set_instance_parameter_value channel_1_phy USE_READDATAVALID 0
set_instance_parameter_value channel_1_phy USE_READRESPONSE 0
set_instance_parameter_value channel_1_phy USE_UAV_CLKEN 0
set_instance_parameter_value channel_1_phy USE_WAITREQUEST 1
set_instance_parameter_value channel_1_phy USE_WRITE 1
set_instance_parameter_value channel_1_phy USE_WRITEBYTEENABLE 0
set_instance_parameter_value channel_1_phy USE_WRITEDATA 1
set_instance_parameter_value channel_1_phy USE_WRITERESPONSE 0

add_instance channel_1_native_phy_rcfg altera_merlin_slave_translator 15.1
set_instance_parameter_value channel_1_native_phy_rcfg AV_ADDRESSGROUP 0
set_instance_parameter_value channel_1_native_phy_rcfg AV_ADDRESS_SYMBOLS 0
set_instance_parameter_value channel_1_native_phy_rcfg AV_ADDRESS_W 10
set_instance_parameter_value channel_1_native_phy_rcfg AV_ALWAYSBURSTMAXBURST 0
set_instance_parameter_value channel_1_native_phy_rcfg AV_BITS_PER_SYMBOL 8
set_instance_parameter_value channel_1_native_phy_rcfg AV_BURSTBOUNDARIES 0
set_instance_parameter_value channel_1_native_phy_rcfg AV_BURSTCOUNT_SYMBOLS 1
set_instance_parameter_value channel_1_native_phy_rcfg AV_BURSTCOUNT_W 1
set_instance_parameter_value channel_1_native_phy_rcfg AV_BYTEENABLE_W 4
set_instance_parameter_value channel_1_native_phy_rcfg AV_CONSTANT_BURST_BEHAVIOR 0
set_instance_parameter_value channel_1_native_phy_rcfg AV_DATA_HOLD 0
set_instance_parameter_value channel_1_native_phy_rcfg AV_DATA_W 32
set_instance_parameter_value channel_1_native_phy_rcfg AV_INTERLEAVEBURSTS 0
set_instance_parameter_value channel_1_native_phy_rcfg AV_ISBIGENDIAN 0
set_instance_parameter_value channel_1_native_phy_rcfg AV_LINEWRAPBURSTS 0
set_instance_parameter_value channel_1_native_phy_rcfg AV_MAX_PENDING_READ_TRANSACTIONS 1
set_instance_parameter_value channel_1_native_phy_rcfg AV_MAX_PENDING_WRITE_TRANSACTIONS 0
set_instance_parameter_value channel_1_native_phy_rcfg AV_READLATENCY 0
set_instance_parameter_value channel_1_native_phy_rcfg AV_READ_WAIT 0
set_instance_parameter_value channel_1_native_phy_rcfg AV_REGISTERINCOMINGSIGNALS 0
set_instance_parameter_value channel_1_native_phy_rcfg AV_REGISTEROUTGOINGSIGNALS 0
set_instance_parameter_value channel_1_native_phy_rcfg AV_REQUIRE_UNALIGNED_ADDRESSES 0
set_instance_parameter_value channel_1_native_phy_rcfg AV_SETUP_WAIT 0
set_instance_parameter_value channel_1_native_phy_rcfg AV_SYMBOLS_PER_WORD 4
set_instance_parameter_value channel_1_native_phy_rcfg AV_TIMING_UNITS 1
set_instance_parameter_value channel_1_native_phy_rcfg AV_WRITE_WAIT 0
set_instance_parameter_value channel_1_native_phy_rcfg CHIPSELECT_THROUGH_READLATENCY 0
set_instance_parameter_value channel_1_native_phy_rcfg CLOCK_RATE 125000000
set_instance_parameter_value channel_1_native_phy_rcfg UAV_ADDRESSGROUP 0
set_instance_parameter_value channel_1_native_phy_rcfg UAV_ADDRESS_W 12
set_instance_parameter_value channel_1_native_phy_rcfg UAV_BURSTCOUNT_W 3
set_instance_parameter_value channel_1_native_phy_rcfg UAV_BYTEENABLE_W 4
set_instance_parameter_value channel_1_native_phy_rcfg UAV_CONSTANT_BURST_BEHAVIOR 0
set_instance_parameter_value channel_1_native_phy_rcfg UAV_DATA_W 32
set_instance_parameter_value channel_1_native_phy_rcfg USE_ADDRESS 1
set_instance_parameter_value channel_1_native_phy_rcfg USE_AV_CLKEN 0
set_instance_parameter_value channel_1_native_phy_rcfg USE_BEGINBURSTTRANSFER 0
set_instance_parameter_value channel_1_native_phy_rcfg USE_BEGINTRANSFER 0
set_instance_parameter_value channel_1_native_phy_rcfg USE_BURSTCOUNT 0
set_instance_parameter_value channel_1_native_phy_rcfg USE_BYTEENABLE 0
set_instance_parameter_value channel_1_native_phy_rcfg USE_CHIPSELECT 0
set_instance_parameter_value channel_1_native_phy_rcfg USE_DEBUGACCESS 0
set_instance_parameter_value channel_1_native_phy_rcfg USE_LOCK 0
set_instance_parameter_value channel_1_native_phy_rcfg USE_OUTPUTENABLE 0
set_instance_parameter_value channel_1_native_phy_rcfg USE_READ 1
set_instance_parameter_value channel_1_native_phy_rcfg USE_READDATA 1
set_instance_parameter_value channel_1_native_phy_rcfg USE_READDATAVALID 0
set_instance_parameter_value channel_1_native_phy_rcfg USE_READRESPONSE 0
set_instance_parameter_value channel_1_native_phy_rcfg USE_UAV_CLKEN 0
set_instance_parameter_value channel_1_native_phy_rcfg USE_WAITREQUEST 1
set_instance_parameter_value channel_1_native_phy_rcfg USE_WRITE 1
set_instance_parameter_value channel_1_native_phy_rcfg USE_WRITEBYTEENABLE 0
set_instance_parameter_value channel_1_native_phy_rcfg USE_WRITEDATA 1
set_instance_parameter_value channel_1_native_phy_rcfg USE_WRITERESPONSE 0

add_instance channel_0_1_traffic_controller altera_merlin_slave_translator 15.1
set_instance_parameter_value channel_0_1_traffic_controller AV_ADDRESSGROUP 0
set_instance_parameter_value channel_0_1_traffic_controller AV_ADDRESS_SYMBOLS 0
set_instance_parameter_value channel_0_1_traffic_controller AV_ADDRESS_W 12
set_instance_parameter_value channel_0_1_traffic_controller AV_ALWAYSBURSTMAXBURST 0
set_instance_parameter_value channel_0_1_traffic_controller AV_BITS_PER_SYMBOL 8
set_instance_parameter_value channel_0_1_traffic_controller AV_BURSTBOUNDARIES 0
set_instance_parameter_value channel_0_1_traffic_controller AV_BURSTCOUNT_SYMBOLS 1
set_instance_parameter_value channel_0_1_traffic_controller AV_BURSTCOUNT_W 1
set_instance_parameter_value channel_0_1_traffic_controller AV_BYTEENABLE_W 4
set_instance_parameter_value channel_0_1_traffic_controller AV_CONSTANT_BURST_BEHAVIOR 0
set_instance_parameter_value channel_0_1_traffic_controller AV_DATA_HOLD 0
set_instance_parameter_value channel_0_1_traffic_controller AV_DATA_W 32
set_instance_parameter_value channel_0_1_traffic_controller AV_INTERLEAVEBURSTS 0
set_instance_parameter_value channel_0_1_traffic_controller AV_ISBIGENDIAN 0
set_instance_parameter_value channel_0_1_traffic_controller AV_LINEWRAPBURSTS 0
set_instance_parameter_value channel_0_1_traffic_controller AV_MAX_PENDING_READ_TRANSACTIONS 1
set_instance_parameter_value channel_0_1_traffic_controller AV_MAX_PENDING_WRITE_TRANSACTIONS 0
set_instance_parameter_value channel_0_1_traffic_controller AV_READLATENCY 0
set_instance_parameter_value channel_0_1_traffic_controller AV_READ_WAIT 0
set_instance_parameter_value channel_0_1_traffic_controller AV_REGISTERINCOMINGSIGNALS 0
set_instance_parameter_value channel_0_1_traffic_controller AV_REGISTEROUTGOINGSIGNALS 0
set_instance_parameter_value channel_0_1_traffic_controller AV_REQUIRE_UNALIGNED_ADDRESSES 0
set_instance_parameter_value channel_0_1_traffic_controller AV_SETUP_WAIT 0
set_instance_parameter_value channel_0_1_traffic_controller AV_SYMBOLS_PER_WORD 4
set_instance_parameter_value channel_0_1_traffic_controller AV_TIMING_UNITS 1
set_instance_parameter_value channel_0_1_traffic_controller AV_WRITE_WAIT 0
set_instance_parameter_value channel_0_1_traffic_controller CHIPSELECT_THROUGH_READLATENCY 0
set_instance_parameter_value channel_0_1_traffic_controller CLOCK_RATE 156250000
set_instance_parameter_value channel_0_1_traffic_controller UAV_ADDRESSGROUP 0
set_instance_parameter_value channel_0_1_traffic_controller UAV_ADDRESS_W 14
set_instance_parameter_value channel_0_1_traffic_controller UAV_BURSTCOUNT_W 3
set_instance_parameter_value channel_0_1_traffic_controller UAV_BYTEENABLE_W 4
set_instance_parameter_value channel_0_1_traffic_controller UAV_CONSTANT_BURST_BEHAVIOR 0
set_instance_parameter_value channel_0_1_traffic_controller UAV_DATA_W 32
set_instance_parameter_value channel_0_1_traffic_controller USE_ADDRESS 1
set_instance_parameter_value channel_0_1_traffic_controller USE_AV_CLKEN 0
set_instance_parameter_value channel_0_1_traffic_controller USE_BEGINBURSTTRANSFER 0
set_instance_parameter_value channel_0_1_traffic_controller USE_BEGINTRANSFER 0
set_instance_parameter_value channel_0_1_traffic_controller USE_BURSTCOUNT 0
set_instance_parameter_value channel_0_1_traffic_controller USE_BYTEENABLE 0
set_instance_parameter_value channel_0_1_traffic_controller USE_CHIPSELECT 0
set_instance_parameter_value channel_0_1_traffic_controller USE_DEBUGACCESS 0
set_instance_parameter_value channel_0_1_traffic_controller USE_LOCK 0
set_instance_parameter_value channel_0_1_traffic_controller USE_OUTPUTENABLE 0
set_instance_parameter_value channel_0_1_traffic_controller USE_READ 1
set_instance_parameter_value channel_0_1_traffic_controller USE_READDATA 1
set_instance_parameter_value channel_0_1_traffic_controller USE_READDATAVALID 0
set_instance_parameter_value channel_0_1_traffic_controller USE_READRESPONSE 0
set_instance_parameter_value channel_0_1_traffic_controller USE_UAV_CLKEN 0
set_instance_parameter_value channel_0_1_traffic_controller USE_WAITREQUEST 1
set_instance_parameter_value channel_0_1_traffic_controller USE_WRITE 1
set_instance_parameter_value channel_0_1_traffic_controller USE_WRITEBYTEENABLE 0
set_instance_parameter_value channel_0_1_traffic_controller USE_WRITEDATA 1
set_instance_parameter_value channel_0_1_traffic_controller USE_WRITERESPONSE 0

# connections
add_connection csr_clk.clk channel_0_mac.clk clock
add_connection csr_clk.clk channel_0_native_phy_rcfg.clk clock
add_connection csr_clk.clk channel_0_phy.clk clock
add_connection csr_clk.clk channel_1_mac.clk clock
add_connection csr_clk.clk channel_1_native_phy_rcfg.clk clock
add_connection csr_clk.clk channel_1_phy.clk clock
add_connection csr_clk.clk jtag_if.clk clock
add_connection csr_clk.clk master_channel.clk clock
add_connection csr_clk.clk mge_reconfig.clk clock
add_connection csr_clk.clk tod_master.clk clock
add_connection mac_clk.clk channel_0_1_traffic_controller.clk clock
add_connection csr_clk.clk_reset channel_0_mac.reset reset
add_connection csr_clk.clk_reset channel_0_native_phy_rcfg.reset reset
add_connection csr_clk.clk_reset channel_0_phy.reset reset
add_connection csr_clk.clk_reset channel_1_mac.reset reset
add_connection csr_clk.clk_reset channel_1_native_phy_rcfg.reset reset
add_connection csr_clk.clk_reset channel_1_phy.reset reset
add_connection csr_clk.clk_reset jtag_if.reset reset
add_connection csr_clk.clk_reset master_channel.reset reset
add_connection csr_clk.clk_reset mge_reconfig.reset reset
add_connection csr_clk.clk_reset tod_master.reset reset
add_connection mac_clk.clk_reset channel_0_1_traffic_controller.reset reset
add_connection jtag_if.avalon_universal_master_0 channel_0_1_traffic_controller.avalon_universal_slave_0 avalon
set_connection_parameter_value jtag_if.avalon_universal_master_0/channel_0_1_traffic_controller.avalon_universal_slave_0 baseAddress 0x00100000
add_connection jtag_if.avalon_universal_master_0 channel_0_mac.avalon_universal_slave_0 avalon
set_connection_parameter_value jtag_if.avalon_universal_master_0/channel_0_mac.avalon_universal_slave_0 baseAddress 0x00010000
add_connection jtag_if.avalon_universal_master_0 channel_0_native_phy_rcfg.avalon_universal_slave_0 avalon
set_connection_parameter_value jtag_if.avalon_universal_master_0/channel_0_native_phy_rcfg.avalon_universal_slave_0 baseAddress 0x0001a000
add_connection jtag_if.avalon_universal_master_0 channel_0_phy.avalon_universal_slave_0 avalon
set_connection_parameter_value jtag_if.avalon_universal_master_0/channel_0_phy.avalon_universal_slave_0 baseAddress 0x00018000
add_connection jtag_if.avalon_universal_master_0 channel_1_mac.avalon_universal_slave_0 avalon
set_connection_parameter_value jtag_if.avalon_universal_master_0/channel_1_mac.avalon_universal_slave_0 baseAddress 0x00020000
add_connection jtag_if.avalon_universal_master_0 channel_1_native_phy_rcfg.avalon_universal_slave_0 avalon
set_connection_parameter_value jtag_if.avalon_universal_master_0/channel_1_native_phy_rcfg.avalon_universal_slave_0 baseAddress 0x0002a000
add_connection jtag_if.avalon_universal_master_0 channel_1_phy.avalon_universal_slave_0 avalon
set_connection_parameter_value jtag_if.avalon_universal_master_0/channel_1_phy.avalon_universal_slave_0 baseAddress 0x00028000
add_connection jtag_if.avalon_universal_master_0 mge_reconfig.avalon_universal_slave_0 avalon
set_connection_parameter_value jtag_if.avalon_universal_master_0/mge_reconfig.avalon_universal_slave_0 baseAddress 0x0000
add_connection jtag_if.avalon_universal_master_0 tod_master.avalon_universal_slave_0 avalon
set_connection_parameter_value jtag_if.avalon_universal_master_0/tod_master.avalon_universal_slave_0 baseAddress 0x4000
add_connection master_channel.avalon_universal_master_0 channel_0_1_traffic_controller.avalon_universal_slave_0 avalon
set_connection_parameter_value master_channel.avalon_universal_master_0/channel_0_1_traffic_controller.avalon_universal_slave_0 baseAddress 0x00100000
add_connection master_channel.avalon_universal_master_0 channel_0_mac.avalon_universal_slave_0 avalon
set_connection_parameter_value master_channel.avalon_universal_master_0/channel_0_mac.avalon_universal_slave_0 baseAddress 0x00010000
add_connection master_channel.avalon_universal_master_0 channel_0_native_phy_rcfg.avalon_universal_slave_0 avalon
set_connection_parameter_value master_channel.avalon_universal_master_0/channel_0_native_phy_rcfg.avalon_universal_slave_0 baseAddress 0x0001a000
add_connection master_channel.avalon_universal_master_0 channel_0_phy.avalon_universal_slave_0 avalon
set_connection_parameter_value master_channel.avalon_universal_master_0/channel_0_phy.avalon_universal_slave_0 baseAddress 0x00018000
add_connection master_channel.avalon_universal_master_0 channel_1_mac.avalon_universal_slave_0 avalon
set_connection_parameter_value master_channel.avalon_universal_master_0/channel_1_mac.avalon_universal_slave_0 baseAddress 0x00020000
add_connection master_channel.avalon_universal_master_0 channel_1_native_phy_rcfg.avalon_universal_slave_0 avalon
set_connection_parameter_value master_channel.avalon_universal_master_0/channel_1_native_phy_rcfg.avalon_universal_slave_0 baseAddress 0x0002a000
add_connection master_channel.avalon_universal_master_0 channel_1_phy.avalon_universal_slave_0 avalon
set_connection_parameter_value master_channel.avalon_universal_master_0/channel_1_phy.avalon_universal_slave_0 baseAddress 0x00028000
add_connection master_channel.avalon_universal_master_0 mge_reconfig.avalon_universal_slave_0 avalon
set_connection_parameter_value master_channel.avalon_universal_master_0/mge_reconfig.avalon_universal_slave_0 baseAddress 0x0000
add_connection master_channel.avalon_universal_master_0 tod_master.avalon_universal_slave_0 avalon
set_connection_parameter_value master_channel.avalon_universal_master_0/tod_master.avalon_universal_slave_0 baseAddress 0x4000

# exported interfaces
add_interface channel_0_1_traffic_controller avalon master
set_interface_property channel_0_1_traffic_controller EXPORT_OF channel_0_1_traffic_controller.avalon_anti_slave_0
add_interface channel_0_mac avalon master
set_interface_property channel_0_mac EXPORT_OF channel_0_mac.avalon_anti_slave_0
add_interface channel_0_native_phy_rcfg avalon master
set_interface_property channel_0_native_phy_rcfg EXPORT_OF channel_0_native_phy_rcfg.avalon_anti_slave_0
add_interface channel_0_phy avalon master
set_interface_property channel_0_phy EXPORT_OF channel_0_phy.avalon_anti_slave_0
add_interface channel_1_mac avalon master
set_interface_property channel_1_mac EXPORT_OF channel_1_mac.avalon_anti_slave_0
add_interface channel_1_native_phy_rcfg avalon master
set_interface_property channel_1_native_phy_rcfg EXPORT_OF channel_1_native_phy_rcfg.avalon_anti_slave_0
add_interface channel_1_phy avalon master
set_interface_property channel_1_phy EXPORT_OF channel_1_phy.avalon_anti_slave_0
add_interface csr_clk clock sink
set_interface_property csr_clk EXPORT_OF csr_clk.clk_in
add_interface csr_clk_reset reset sink
set_interface_property csr_clk_reset EXPORT_OF csr_clk.clk_in_reset
add_interface jtag_slave avalon slave
set_interface_property jtag_slave EXPORT_OF jtag_if.avalon_anti_master_0
add_interface mac_clk clock sink
set_interface_property mac_clk EXPORT_OF mac_clk.clk_in
add_interface mac_clk_reset reset sink
set_interface_property mac_clk_reset EXPORT_OF mac_clk.clk_in_reset
add_interface mge_reconfig avalon master
set_interface_property mge_reconfig EXPORT_OF mge_reconfig.avalon_anti_slave_0
add_interface slave avalon slave
set_interface_property slave EXPORT_OF master_channel.avalon_anti_master_0
add_interface tod_master avalon master
set_interface_property tod_master EXPORT_OF tod_master.avalon_anti_slave_0

set_interconnect_requirement {$system} qsys_mm.clockCrossingAdapter HANDSHAKE
set_interconnect_requirement {$system} qsys_mm.maxAdditionalLatency 1

save_system alt_mge_rd_addrdec_mch_a10.qsys
